# Altium schematic sheet 6-BOOT_SELECT.SchDoc
size B
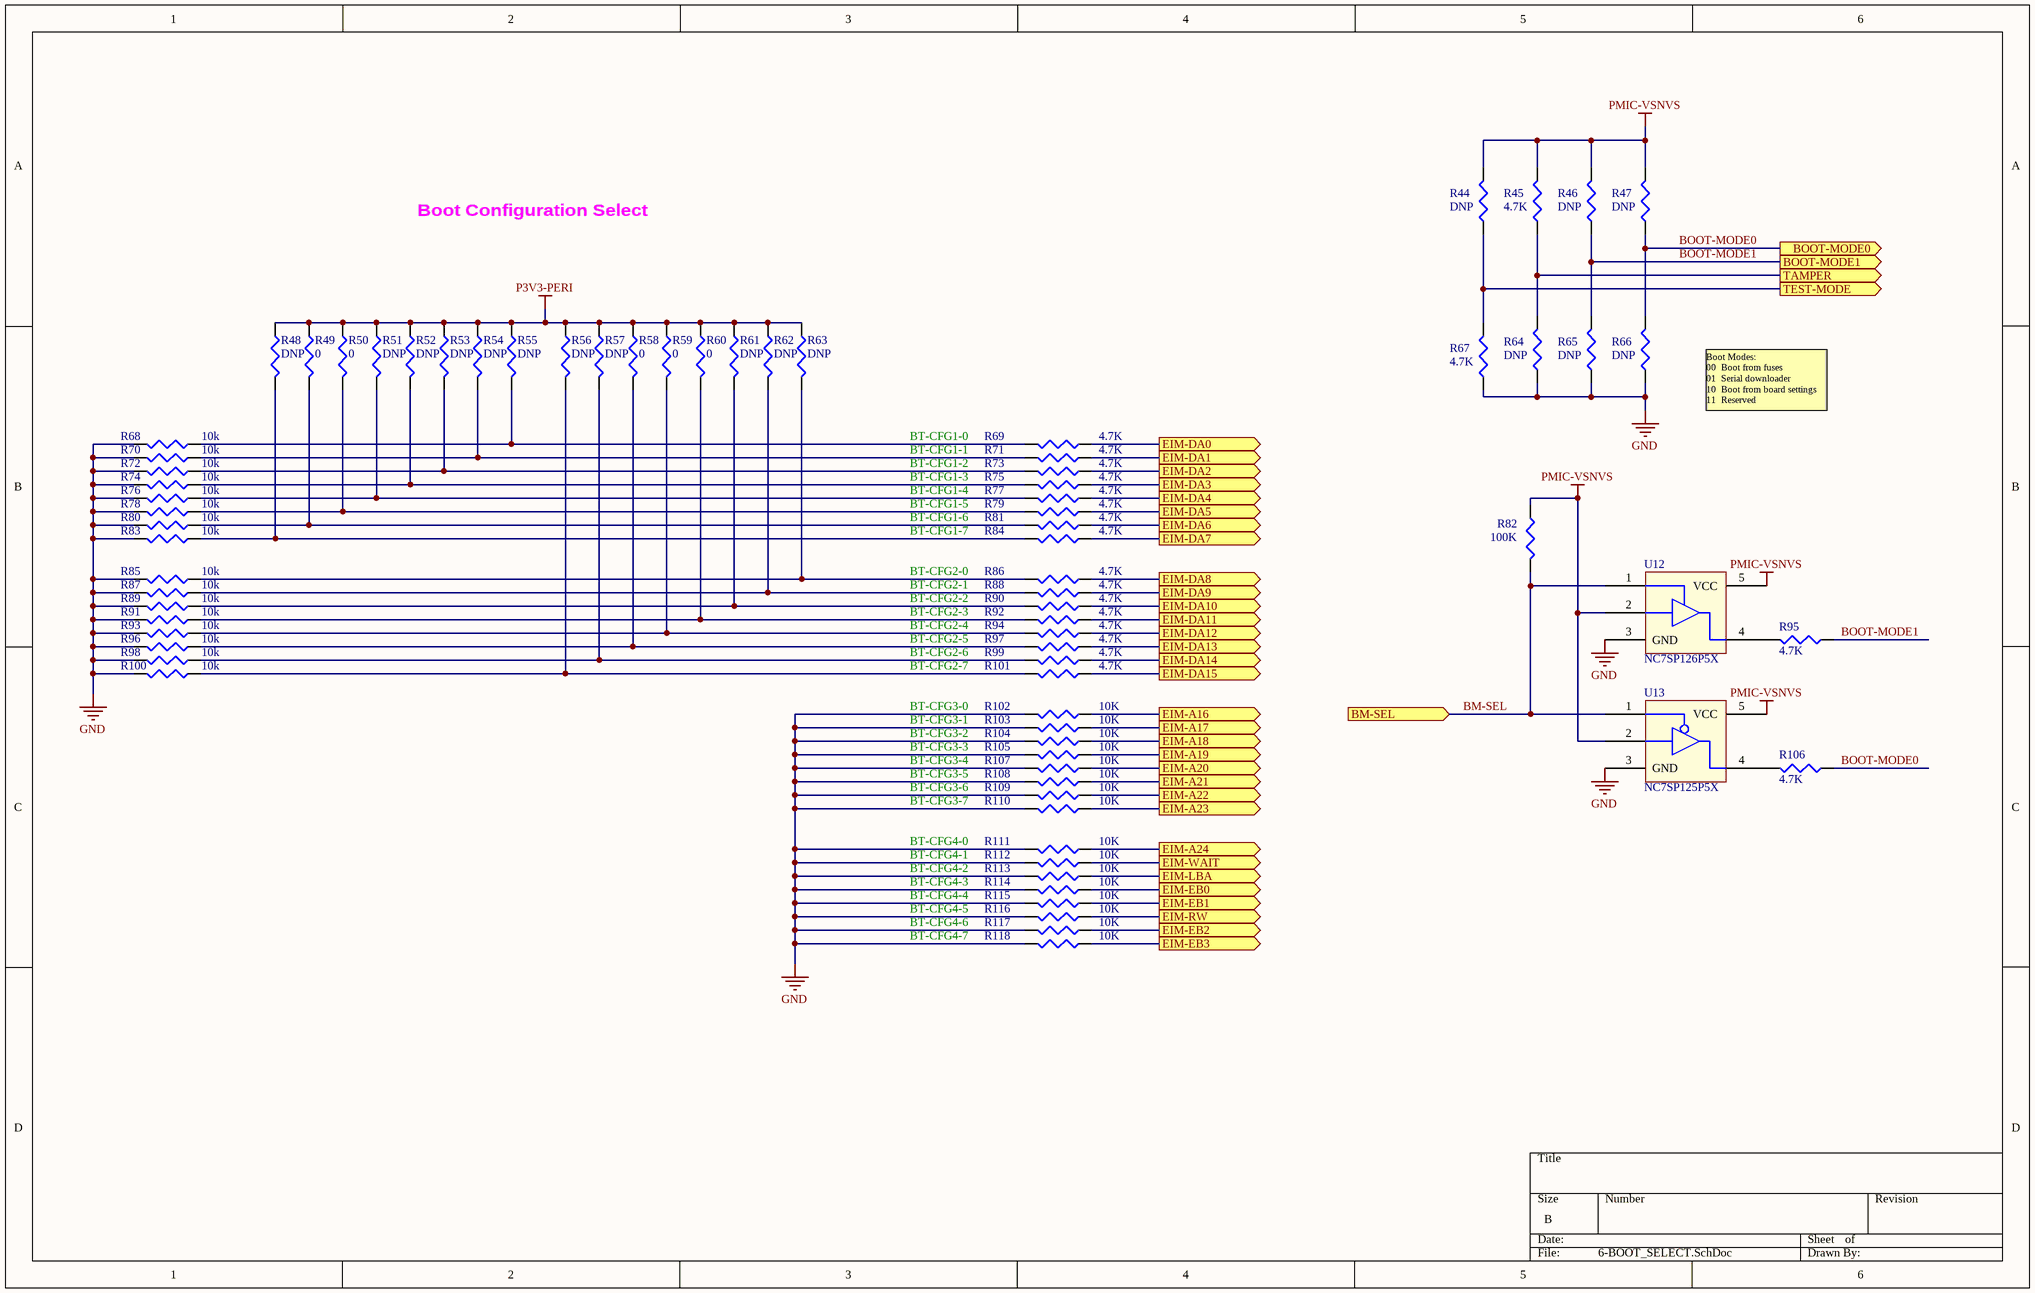
[diagram p0: 6-BOOT_SELECT.SchDoc]

## Parts
R44  DNP  [0402_CC]
R45  4.7K  [0402_CC]
R46  DNP  [0402_CC]
R47  DNP  [0402_CC]
R48  DNP  [0402_CC]
R49  0  [0402_CC]
R50  0  [0402_CC]
R51  DNP  [0402_CC]
R52  DNP  [0402_CC]
R53  DNP  [0402_CC]
R54  DNP  [0402_CC]
R55  DNP  [0402_CC]
R56  DNP  [0402_CC]
R57  DNP  [0402_CC]
R58  0  [0402_CC]
R59  0  [0402_CC]
R60  0  [0402_CC]
R61  DNP  [0402_CC]
R62  DNP  [0402_CC]
R63  DNP  [0402_CC]
R64  DNP  [0402_CC]
R65  DNP  [0402_CC]
R66  DNP  [0402_CC]
R67  4.7K  [0402_CC]
R68  10k  [0402_CC]
R69  4.7K  [0402_CC]
R70  10k  [0402_CC]
R71  4.7K  [0402_CC]
R72  10k  [0402_CC]
R73  4.7K  [0402_CC]
R74  10k  [0402_CC]
R75  4.7K  [0402_CC]
R76  10k  [0402_CC]
R77  4.7K  [0402_CC]
R78  10k  [0402_CC]
R79  4.7K  [0402_CC]
R80  10k  [0402_CC]
R81  4.7K  [0402_CC]
R82  100K  [0402_CC]
R83  10k  [0402_CC]
R84  4.7K  [0402_CC]
R85  10k  [0402_CC]
R86  4.7K  [0402_CC]
R87  10k  [0402_CC]
R88  4.7K  [0402_CC]
R89  10k  [0402_CC]
R90  4.7K  [0402_CC]
R91  10k  [0402_CC]
R92  4.7K  [0402_CC]
R93  10k  [0402_CC]
R94  4.7K  [0402_CC]
R95  4.7K  [0402_CC]
R96  10k  [0402_CC]
R97  4.7K  [0402_CC]
R98  10k  [0402_CC]
R99  4.7K  [0402_CC]
R100  10k  [0402_CC]
R101  4.7K  [0402_CC]
R102  10K  [0402_CC]
R103  10K  [0402_CC]
R104  10K  [0402_CC]
R105  10K  [0402_CC]
R106  4.7K  [0402_CC]
R107  10K  [0402_CC]
R108  10K  [0402_CC]
R109  10K  [0402_CC]
R110  10K  [0402_CC]
R111  10K  [0402_CC]
R112  10K  [0402_CC]
R113  10K  [0402_CC]
R114  10K  [0402_CC]
R115  10K  [0402_CC]
R116  10K  [0402_CC]
R117  10K  [0402_CC]
R118  10K  [0402_CC]
U12  NC7SP126P5X  [SC70]
U13  NC7SP125P5X  [SC70]

## Ports
BM-SEL (in), BOOT-MODE0 (out), BOOT-MODE1 (out), EIM-A16 (out), EIM-A17 (out), EIM-A18 (out), EIM-A19 (out), EIM-A20 (out), EIM-A21 (out), EIM-A22 (out), EIM-A23 (out), EIM-A24 (out), EIM-DA0 (out), EIM-DA1 (out), EIM-DA2 (out), EIM-DA3 (out), EIM-DA4 (out), EIM-DA5 (out), EIM-DA6 (out), EIM-DA7 (out), EIM-DA8 (out), EIM-DA9 (out), EIM-DA10 (out), EIM-DA11 (out), EIM-DA12 (out), EIM-DA13 (out), EIM-DA14 (out), EIM-DA15 (out), EIM-EB0 (out), EIM-EB1 (out), EIM-EB2 (out), EIM-EB3 (out), EIM-LBA (out), EIM-RW (out), EIM-WAIT (out), TAMPER (out), TEST-MODE (out)

## Nets
GND: R64.1 R65.1 R66.1 R67.1 R68.2 R70.2 R72.2 R74.2 R76.2 R78.2 R80.2 R83.2 R85.2 R87.2 R89.2 R91.2 R93.2 R96.2 R98.2 R100.2 R102.2 R103.2 R104.2 R105.2 R107.2 R108.2 R109.2 R110.2 R111.2 R112.2 R113.2 R114.2 R115.2 R116.2 R117.2 R118.2 U12.3(GND) U13.3(GND)
P3V3-PERI: R48.1 R49.1 R50.1 R51.1 R52.1 R53.1 R54.1 R55.1 R56.1 R57.1 R58.1 R59.1 R60.1 R61.1 R62.1 R63.1
PMIC-VSNVS: R44.2 R45.2 R46.2 R47.2 R82.1 U12.2(A) U12.5(VCC) U13.2(A) U13.5(VCC)
BM-SEL: R82.2 U12.1(OE) U13.1(OE) ; port BM-SEL
BOOT-MODE0: R47.1 R66.2 R106.1 ; port BOOT-MODE0
BOOT-MODE1: R46.1 R65.2 R95.1 ; port BOOT-MODE1
EIM-A16: R102.1 ; port EIM-A16
EIM-A17: R103.1 ; port EIM-A17
EIM-A18: R104.1 ; port EIM-A18
EIM-A19: R105.1 ; port EIM-A19
EIM-A20: R107.1 ; port EIM-A20
EIM-A21: R108.1 ; port EIM-A21
EIM-A22: R109.1 ; port EIM-A22
EIM-A23: R110.1 ; port EIM-A23
EIM-A24: R111.1 ; port EIM-A24
EIM-DA0: R69.1 ; port EIM-DA0
EIM-DA1: R71.1 ; port EIM-DA1
EIM-DA2: R73.1 ; port EIM-DA2
EIM-DA3: R75.1 ; port EIM-DA3
EIM-DA4: R77.1 ; port EIM-DA4
EIM-DA5: R79.1 ; port EIM-DA5
EIM-DA6: R81.1 ; port EIM-DA6
EIM-DA7: R84.1 ; port EIM-DA7
EIM-DA8: R86.1 ; port EIM-DA8
EIM-DA9: R88.1 ; port EIM-DA9
EIM-DA10: R90.1 ; port EIM-DA10
EIM-DA11: R92.1 ; port EIM-DA11
EIM-DA12: R94.1 ; port EIM-DA12
EIM-DA13: R97.1 ; port EIM-DA13
EIM-DA14: R99.1 ; port EIM-DA14
EIM-DA15: R101.1 ; port EIM-DA15
EIM-EB0: R114.1 ; port EIM-EB0
EIM-EB1: R115.1 ; port EIM-EB1
EIM-EB2: R117.1 ; port EIM-EB2
EIM-EB3: R118.1 ; port EIM-EB3
EIM-LBA: R113.1 ; port EIM-LBA
EIM-RW: R116.1 ; port EIM-RW
EIM-WAIT: R112.1 ; port EIM-WAIT
TAMPER: R45.1 R64.2 ; port TAMPER
TEST-MODE: R44.1 R67.2 ; port TEST-MODE
NetR48_2: R48.2 R83.1 R84.2
NetR49_2: R49.2 R80.1 R81.2
NetR50_2: R50.2 R78.1 R79.2
NetR51_2: R51.2 R76.1 R77.2
NetR52_2: R52.2 R74.1 R75.2
NetR53_2: R53.2 R72.1 R73.2
NetR54_2: R54.2 R70.1 R71.2
NetR55_2: R55.2 R68.1 R69.2
NetR56_2: R56.2 R100.1 R101.2
NetR57_2: R57.2 R98.1 R99.2
NetR58_2: R58.2 R96.1 R97.2
NetR59_2: R59.2 R93.1 R94.2
NetR60_2: R60.2 R91.1 R92.2
NetR61_2: R61.2 R89.1 R90.2
NetR62_2: R62.2 R87.1 R88.2
NetR63_2: R63.2 R85.1 R86.2
NetR95_2: R95.2 U12.4(Y)
NetR106_2: R106.2 U13.4(Y)

## Notes on the sheet
- Boot Configuration Select
- Boot Modes:
  00  Boot from fuses
  01  Serial downloader
  10  Boot from board settings
  11  Reserved
- BT-CFG1-0
- BT-CFG1-1
- BT-CFG1-2
- BT-CFG1-3
- BT-CFG1-4
- BT-CFG1-5
- BT-CFG1-6
- BT-CFG1-7
- BT-CFG2-0
- BT-CFG2-1
- BT-CFG2-2
- BT-CFG2-3
- BT-CFG2-4
- BT-CFG2-5
- BT-CFG2-6
- BT-CFG2-7
- BT-CFG3-0
- BT-CFG3-1
- BT-CFG3-2
- BT-CFG3-3
- BT-CFG3-4
- BT-CFG3-5
- BT-CFG3-6
- BT-CFG3-7
- BT-CFG4-0
- BT-CFG4-1
- BT-CFG4-2
- BT-CFG4-3
- BT-CFG4-4
- BT-CFG4-5
- BT-CFG4-6
- BT-CFG4-7

## Library data of the parts
R44-R118 = Res3: Resistor; Published: 8-Jun-2000; LatestRevisionDate: 29-May-2009; LatestRevisionNote: IPC-7351 Footprint Added.; PackageReference: J1-0603; Publisher: Altium Limited; PackageDescription: Chip Resistor